# Altium schematic sheet MotorDriver.SchDoc
size A4
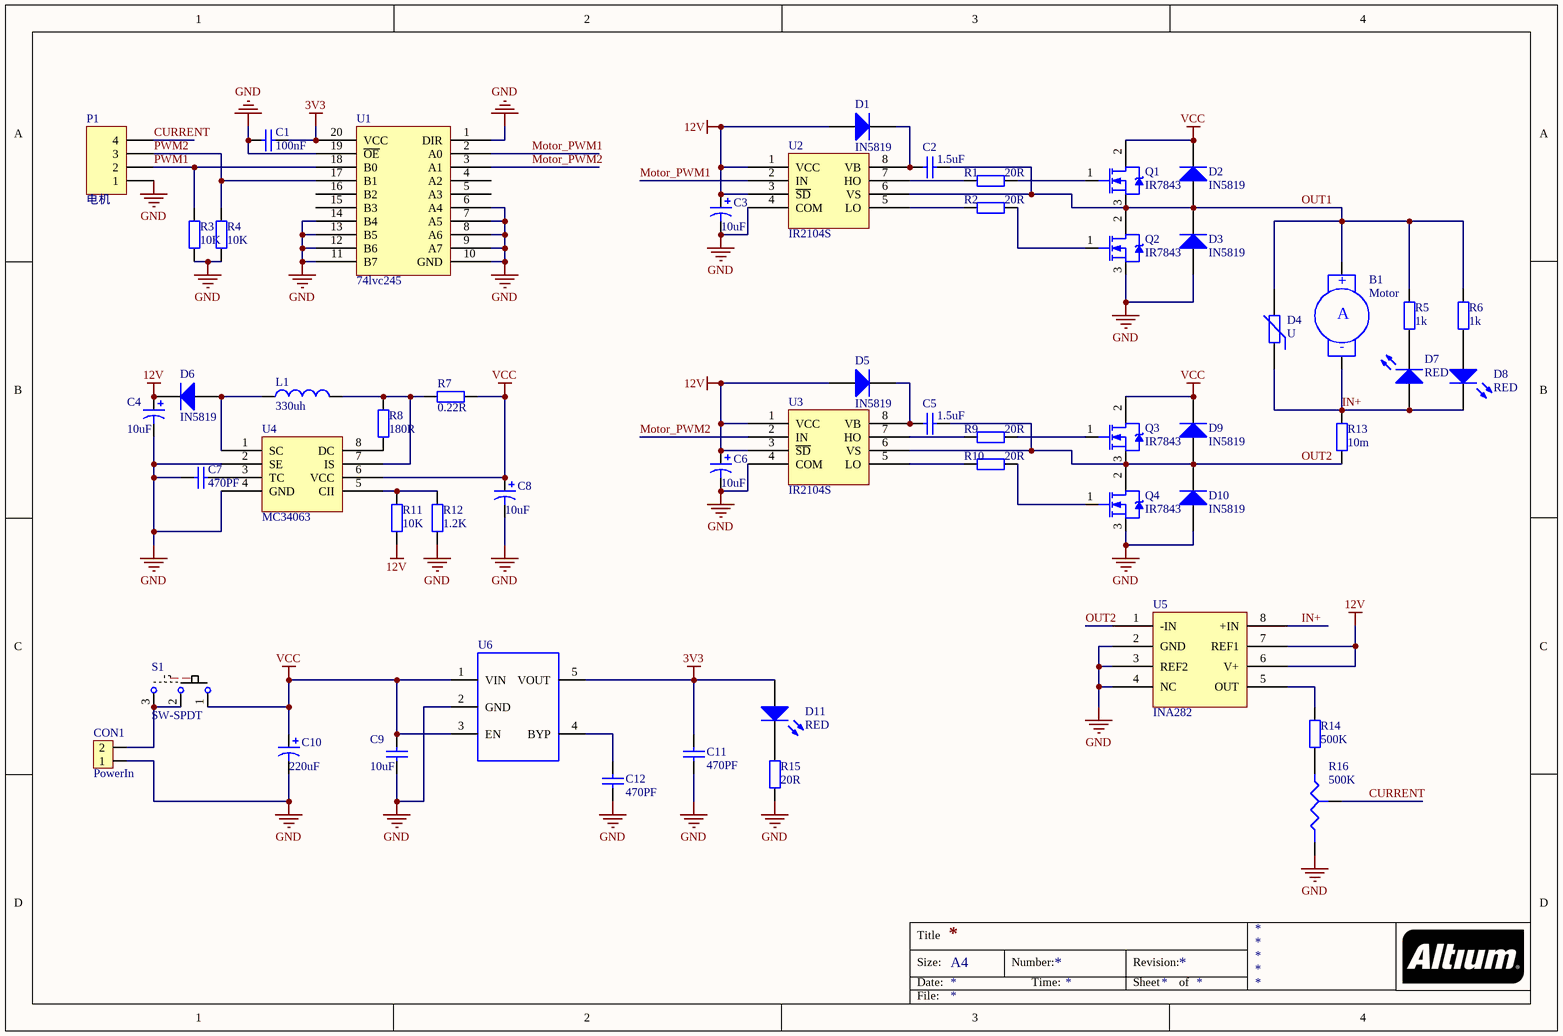
[diagram p0: MotorDriver.SchDoc]

## Parts
B1  Motor  [KF301-2P]
C1  value 100nF  [0603C]  (hidden comment: Cap)
C2  value 1.5uF  [0603C]  (hidden comment: Cap)
C3  value 10uF  [0603C]  (hidden comment: Cap Pol1)
C4  value 10uF  [0603C]  (hidden comment: Cap Pol1)
C5  value 1.5uF  [0603C]  (hidden comment: Cap)
C6  value 10uF  [0603C]  (hidden comment: Cap Pol1)
C7  value 470PF  [0603C]  (hidden comment: Cap)
C8  value 10uF  [0603C]  (hidden comment: Cap Pol1)
C9  value 10uF  [0603C]  (hidden comment: Cap)
C10  value 220uF  [Cap-Pol-220uf16V]  (hidden comment: Cap Pol1)
C11  value 470PF  [0603C]  (hidden comment: Cap)
C12  value 470PF  [0603C]  (hidden comment: Cap)
CON1  PowerIn  [KF301-2P]
D1  IN5819  [DL-41 - duplicate]
D2  IN5819  [DL-41 - duplicate]
D3  IN5819  [DL-41 - duplicate]
D4  U  [0805(2012)]
D5  IN5819  [DL-41]
D6  IN5819  [DL-41 - duplicate]
D7  RED  [0805LED]
D8  RED  [0805LED]
D9  IN5819  [DL-41 - duplicate]
D10  IN5819  [DL-41 - duplicate]
D11  RED  [0805LED]
L1  value 330uh  [电感8*8_1]  (hidden comment: Inductor)
P1  电机  [XH1X4]
Q1  IR7843  [LR7843]
Q2  IR7843  [LR7843]
Q3  IR7843  [LR7843]
Q4  IR7843  [LR7843]
R1  value 20R  [0603R]  (hidden comment: Res2)
R2  value 20R  [0603R]  (hidden comment: Res2)
R3  value 10K  [0603R]  (hidden comment: Res2)
R4  value 10K  [0603R]  (hidden comment: Res2)
R5  value 1k  [0603R]  (hidden comment: Res2)
R6  value 1k  [0603R]  (hidden comment: Res2)
R7  value 0.22R  [0603R]  (hidden comment: Res2)
R8  value 180R  [0603R]  (hidden comment: Res2)
R9  value 20R  [0603R]  (hidden comment: Res2)
R10  value 20R  [0603R]  (hidden comment: Res2)
R11  value 10K  [0603R]  (hidden comment: Res2)
R12  value 1.2K  [0603R]  (hidden comment: Res2)
R13  value 10m  [0603R]  (hidden comment: Res2)
R14  value 500K  [0603R]  (hidden comment: Res2)
R15  value 20R  [0603R]  (hidden comment: Res2)
R16  500K  [VR_3362P]
S1  SW-SPDT  [SWICH_2]
U1  74lvc245  [74lvc245 TSSOP]
U2  IR2104S  [SOIC-8]
U3  IR2104S  [SOIC-8]
U4  MC34063  [SOIC-8]
U5  INA282  [SOIC-8]
U6  MIC5219  [SOT23-5]  (value not drawn)

## Nets
3V3: C1.1 C11.2 D11.1(A) U1.20(VCC) U6.5(VOUT)
12V: C3.1 C4.1 C6.1 D1.1(A) D5.1(A) D6.2(K) R11.2 U2.1(VCC) U2.3(~{SD}) U3.1(VCC) U3.3(~{SD}) U5.6(V+) U5.7(REF1)
GND: C1.2 C3.2 C4.2 C6.2 C7.2 C8.2 C9.1 C10.2 C11.1 C12.1 CON1.1 D3.1(A) D10.1(A) P1.1 Q2.3(S) Q4.3(S) R3.2 R4.2 R12.2 R15.1 R16.3 U1.1(DIR) U1.6(A4) U1.7(A5) U1.8(A6) U1.9(A7) U1.10(GND) U1.11(B7) U1.12(B6) U1.13(B5) U1.14(B4) U1.19(~{OE}) U2.4(COM) U3.4(COM) U4.2(SE) U4.4(GND) U5.2(GND) U5.3(REF2) U5.4(NC) U6.2(GND)
VCC: C8.1 C9.2 C10.1 D2.2(K) D9.2(K) Q1.2(D) Q3.2(D) R7.1 S1.1 U4.6(VCC) U6.1(VIN) U6.3(EN)
CURRENT: P1.4 R16.2
IN+: B1.2(-) D4.1 D7.1(A) D8.2(K) R13.2 U5.8(+IN)
Motor_PWM1: U1.2(A0) U2.2(IN)
Motor_PWM2: U1.3(A1) U3.2(IN)
OUT1: B1.1(+) C2.2 D2.1(A) D3.2(K) D4.2 Q1.3(S) Q2.2(D) R5.2 R6.2 U2.6(VS)
OUT2: C5.2 D9.1(A) D10.2(K) Q3.3(S) Q4.2(D) R13.1 U3.6(VS) U5.1(-IN)
PWM1: P1.2 R3.1 U1.18(B0)
PWM2: P1.3 R4.1 U1.17(B1)
NetC2_1: C2.1 D1.2(K) U2.8(VB)
NetC5_1: C5.1 D5.2(K) U3.8(VB)
NetC7_1: C7.1 U4.3(TC)
NetC12_2: C12.2 U6.4(BYP)
NetCON1_2: CON1.2 S1.2 S1.3
NetD6_1: D6.1(A) L1.1 U4.1(SC)
NetD7_2: D7.2(K) R5.1
NetD8_1: D8.1(A) R6.1
NetD11_2: D11.2(K) R15.2
NetL1_2: L1.2 R7.2 R8.2 U4.7(IS)
NetQ1_1: Q1.1(G) R1.2
NetQ2_1: Q2.1(G) R2.2
NetQ3_1: Q3.1(G) R9.2
NetQ4_1: Q4.1(G) R10.2
NetR1_1: R1.1 U2.7(HO)
NetR2_1: R2.1 U2.5(LO)
NetR8_1: R8.1 U4.8(DC)
NetR9_1: R9.1 U3.7(HO)
NetR10_1: R10.1 U3.5(LO)
NetR11_1: R11.1 R12.1 U4.5(CII)
NetR14_1: R14.1 R16.1
NetR14_2: R14.2 U5.5(OUT)

Not connected (* = marked no-connect by the designer): U1 4(A2) 5(A3) 15(B3) 16(B2)

## Notes on the sheet
- Title
- Size:
- Date:
- A4
- Number:
- Time:
- Revision:
- Sheet
- of
- File:
- (in symbol Motor Servo) A

## Library data of the parts
B1 = Motor Servo: Servo Motor
C1 C2 C5 C7 C9 C11 C12 = Cap: Capacitor; Published: 8-Jun-2000; LatestRevisionDate: 17-Jul-2002; LatestRevisionNote: Re-released for DXP Platform.; PackageReference: RAD-0.3; Publisher: Altium Limited; PackageDescription: Radial Cap, Thru-Hole; 2 Leads; 0.3 in Pin Spacing
C3 C4 C6 C8 C10 = Cap Pol1: Polarized Capacitor (Radial); Published: 8-Jun-2000; LatestRevisionDate: 17-Jul-2002; LatestRevisionNote: Re-released for DXP Platform.; PackageReference: RB7.6-15; Publisher: Altium Limited; PackageDescription: Polarized Capacitor (Radial); 2 Leads
CON1 = Header 2: Header, 2-Pin
D1-D3 D5 D6 D9 D10 = Diode: Default Diode; PackageVersion: Sep-1996; PackageDescription: DO-214-AB/SMC; 2 C-Bend Leads; Body 7.9 x 5.9 mm, inc. leads (LxW); Code_JEDEC: DO-214-AB
D4 = Res Varistor: Varistor (Voltage-Sensitive Resistor); Published: 24-Mar-1999; LatestRevisionDate: 29-May-2009; LatestRevisionNote: IPC-7351 Footprint Added.; PackageVersion: Mar-2003; PackageReference: 6-0805; Publisher: Altium Limited; PackageDescription: Chip Resistor 0805 Case Size; Code_IPC: RESC2012
D7 D8 D11 = LED2: Typical RED, GREEN, YELLOW, AMBER GaAs LED; Published: 8-Jun-2000; LatestRevisionDate: 17-Jul-2002; LatestRevisionNote: Re-released for DXP Platform.; PackageVersion: Feb-2002; PackageReference: 3.2X1.6X1.1; Publisher: Altium Limited; PackageDescription: SM LED; 2 Flat Leads
L1 = Inductor: Code_IEC: 1005; Published: 8-Jun-2000; LatestRevisionDate: 29-May-2009; LatestRevisionNote: IPC-7351 Footprint Added.; PackageReference: 0402-A; Publisher: Altium Limited; PackageDescription: Chip Inductor; Code_JEITA: 0402
P1 = Header 4: Header, 4-Pin; LatestRevisionDate: 17-Jul-2002; LatestRevisionNote: Re-released for DXP Platform.; Publisher: Altium Limited
Q1-Q4 = NMOS-2: N-Channel Power MOSFET; Note: Pin 2 is electrically connected to pin 4.; Published: 8-Jun-2000; LatestRevisionDate: 17-Jul-2002; LatestRevisionNote: Re-released for DXP Platform.; DatasheetVersion: PD-9.814; PackageVersion: Feb-1997; PackageReference: TO-220AB; Publisher: Altium Limited; PackageDescription: TO, Thru-Hole, Vertical, Heatsink Mounted; 3 In-Line Leads; Pitch 2.54 mm; ComponentLink1Description: Manufacturer Link; ComponentLink1URL: http://www.irf.com/
R1-R15 = Res2: Resistor; Published: 8-Jun-2000; LatestRevisionDate: 17-Jul-2002; LatestRevisionNote: Re-released for DXP Platform.; PackageReference: AXIAL-0.4; Publisher: Altium Limited; PackageDescription: Axial Device, Thru-Hole; 2 Leads; 0.4 in Pin Spacing
R16 = RES-ADJ
S1 = SW-SPDT: SPDT Subminiature Toggle Switch, Right Angle Mounting, Vertical Actuation
U1 = 74lvc245: 8位5伏转3.3伏电平转换芯片
U6 = MIC5219: LDO